# EAGLE schematic atmega_328p_blink (EAGLE 9.1.3)
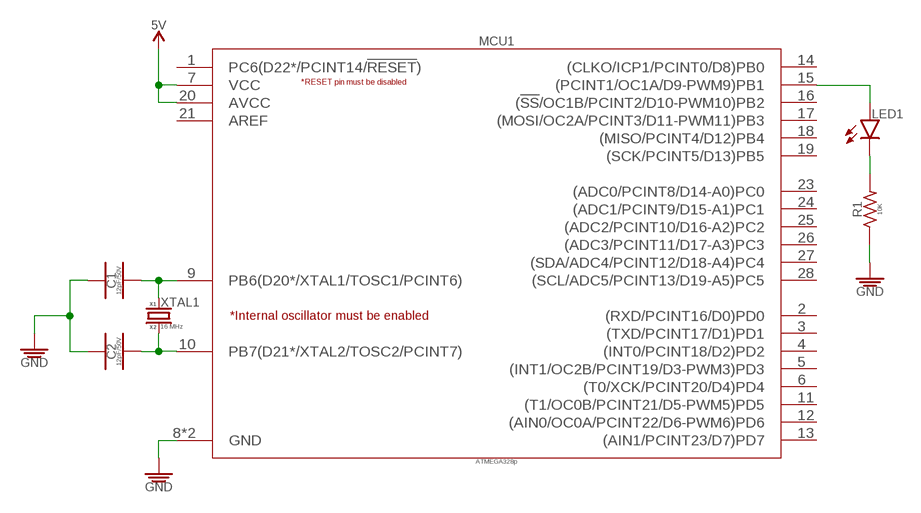
[diagram p0: schematic, sheet 1]

## Parts
C1  12pF/50V  12PF_PTH-CER_50V-5%  [_CER_PTH_LS2.5_L4-W2.5-H5.58]
C2  12pF/50V  12PF_PTH-CER_50V-5%  [_CER_PTH_LS2.5_L4-W2.5-H5.58]
LED1  LED_PTH_T-1_3/4_5MM_NO-COLOR  [LED_PTH_T-1_3/4_5MM]
MCU1  ATMEGA328p  ATMEGA328P-28_28-PDIP_8BIT_32KB  [DIP762W53P254L3467H472Q28B]
R1  10K  10KΩ_PTH-207/10_1/4W-5%  [RESAD990W55L630D240B]
XTAL1  16 MHz  CRYSTAL_ABL_16MHZ_18PF  [HC-49/US]

## Nets
5V: MCU1.7(VCC) MCU1.20(AVCC)
GND: C1.P$1 C2.P$1 MCU1.8(GND) MCU1.22(GND) R1.1
N$2: C2.P$2 MCU1.10(PB7(D21*/XTAL2/TOSC2/PCINT7)) XTAL1.P$2(XTAL2)
N$3: C1.P$2 MCU1.9(PB6(D20*/XTAL1/TOSC1/PCINT6)) XTAL1.P$1(XTAL1)
N$4: LED1.A MCU1.15((PCINT1/OC1A/D9-PWM9)PB1)
N$5: LED1.K R1.2
Unconnected: MCU1.1(PC6(D22*/PCINT14/!RESET!)) MCU1.2((RXD/PCINT16/D0)PD0) MCU1.3((TXD/PCINT17/D1)PD1) MCU1.4((INT0/PCINT18/D2)PD2) MCU1.5((INT1/OC2B/PCINT19/D3-PWM3)PD3) MCU1.6((T0/XCK/PCINT20/D4)PD4) MCU1.11((T1/OC0B/PCINT21/D5-PWM5)PD5) MCU1.12((AIN0/OC0A/PCINT22/D6-PWM6)PD6) MCU1.13((AIN1/PCINT23/D7)PD7) MCU1.14((CLKO/ICP1/PCINT0/D8)PB0) MCU1.16((!SS!/OC1B/PCINT2/D10-PWM10)PB2) MCU1.17((MOSI/OC2A/PCINT3/D11-PWM11)PB3) MCU1.18((MISO/PCINT4/D12)PB4) MCU1.19((SCK/PCINT5/D13)PB5) MCU1.21(AREF) MCU1.23((ADC0/PCINT8/D14-A0)PC0) MCU1.24((ADC1/PCINT9/D15-A1)PC1) MCU1.25((ADC2/PCINT10/D16-A2)PC2) MCU1.26((ADC3/PCINT11/D17-A3)PC3) MCU1.27((SDA/ADC4/PCINT12/D18-A4)PC4) MCU1.28((SCL/ADC5/PCINT13/D19-A5)PC5)

## Library data of the parts
C1 C2 = PiB_capacitors:12PF; DATASHEET: http://www.vishay.com/docs/45171/kseries.pdf; DIST: Digikey; DISTLINK: https://www.digikey.com/products/en?keywords=BC1002CT-ND; DISTPN: BC1002CT-ND; MFR: Vishay BC Components; MPN: K120J15C0GF5TL2
LED1 = PiB_leds:LED
MCU1 = PiB_ic_microcontrollers:ATMEGA328P-28: ATMEGA328P 28PIN IC; DATASHEET: http://ww1.microchip.com/downloads/en/DeviceDoc/Atmel-42735-8-bit-AVR-Microcontroller-ATmega328-328P_Datasheet.pdf; DIST: Digikey; DISTLINK: https://www.digikey.com/products/en?keywords=ATMEGA328P-PU-ND; DISTPN: ATMEGA328P-PU-ND; MFR: Microchip Technology; MPN: ATMEGA328P-PU
R1 = PiB_resistors:10KΩ; DATASHEET: http://www.yageo.com/NewPortal/yageodocoutput?fileName=/pdf/throughhole/Yageo_LR_CFR_2013.pdf; DIST: Digikey; DISTLINK: https://www.digikey.com/products/en?keywords=CFR-25JB-52-10K; DISTPN: 10KQBK-ND; MFR: Yageo; MPN: CFR-25JB-52-10K
XTAL1 = PiB_crystals_oscillators_resonators:CRYSTAL: Various standard crystals. Proven footprints.; DATASHEET: https://abracon.com/Resonators/ABL.pdf; DIST: Digikey; DISTLINK: https://www.digikey.com/products/en?keywords=535-9041-ND; DISTPN: 535-9041-ND; MFR: Abracon LLC; MPN: ABL-16.000MHZ-B2